# Altium schematic sheet STM32H745.SchDoc
size A
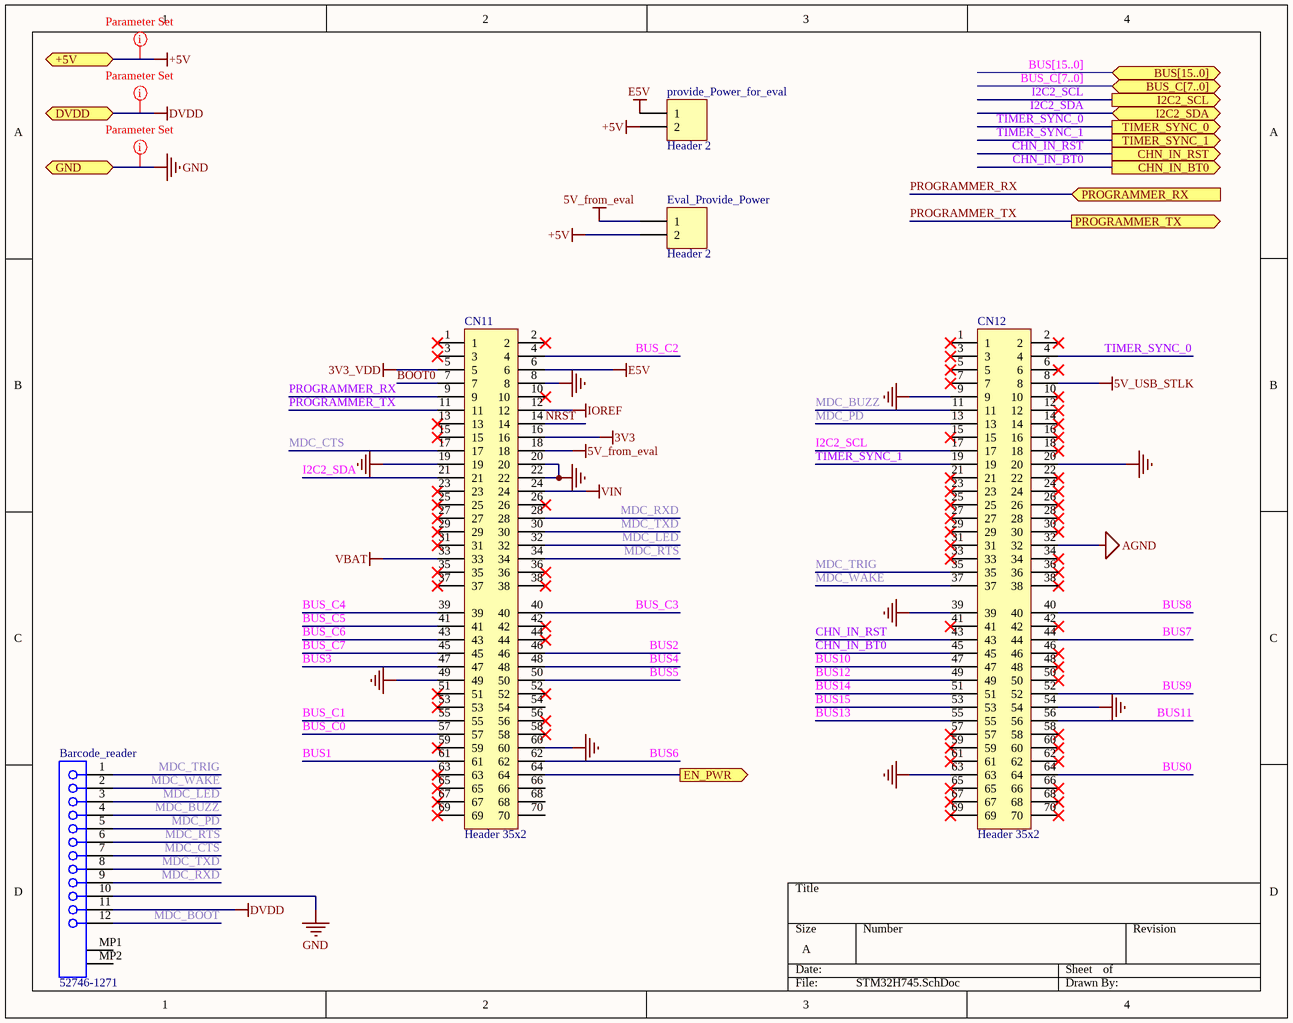
[diagram p0: STM32H745.SchDoc]

## Parts
Barcode_reader  52746-1271  [MOLX-52746-1271]
CN11  Header 35x2  [HDR_2x36_2R54_V_M]
CN12  Header 35x2  [HDR_2x36_2R54_V_M]
Eval_Provide_Power  Header 2  [HDR1X2]
provide_Power_for_eval  Header 2  [HDR1X2]

## Ports
+5V (bidir), BUS[15..0] (bidir), BUS_C[7..0] (bidir), CHN_IN_BT0 (out), CHN_IN_RST (out), DVDD (bidir), EN_PWR (out), GND (bidir), I2C2_SCL (out), I2C2_SDA (bidir), PROGRAMMER_RX (in), PROGRAMMER_TX (out), TIMER_SYNC_0 (out), TIMER_SYNC_1 (out)

## Nets
3V3: CN11.16
3V3_VDD: CN11.5
5V_from_eval: CN11.18 Eval_Provide_Power.1
5V_USB_STLK: CN12.8
+5V: Eval_Provide_Power.2 provide_Power_for_eval.2 ; port +5V
AGND: CN12.32
DVDD: Barcode_reader.11 ; port DVDD
E5V: CN11.6 provide_Power_for_eval.1
GND: Barcode_reader.10 CN11.8 CN11.19 CN11.20 CN11.22 CN11.49 CN11.60 CN12.9 CN12.20 CN12.39 CN12.54 CN12.63 ; port GND
IOREF: CN11.12
VBAT: CN11.33
VIN: CN11.24
BOOT0: CN11.7
BUS0: CN12.64
BUS1: CN11.61
BUS2: CN11.46
BUS3: CN11.47
BUS4: CN11.48
BUS5: CN11.50
BUS6: CN11.62
BUS7: CN12.44
BUS8: CN12.40
BUS9: CN12.52
BUS10: CN12.47
BUS11: CN12.56
BUS12: CN12.49
BUS13: CN12.55
BUS14: CN12.51
BUS15: CN12.53
BUS_C0: CN11.57
BUS_C1: CN11.55
BUS_C2: CN11.4
BUS_C3: CN11.40
BUS_C4: CN11.39
BUS_C5: CN11.41
BUS_C6: CN11.43
BUS_C7: CN11.45
CHN_IN_BT0: CN12.45 ; port CHN_IN_BT0
CHN_IN_RST: CN12.43 ; port CHN_IN_RST
EN_PWR: CN11.64 ; port EN_PWR
I2C2_SCL: CN12.17 ; port I2C2_SCL
I2C2_SDA: CN11.21 ; port I2C2_SDA
MDC_BOOT: Barcode_reader.12
MDC_BUZZ: Barcode_reader.4 CN12.11
MDC_CTS: Barcode_reader.7 CN11.17
MDC_LED: Barcode_reader.3 CN11.32
MDC_PD: Barcode_reader.5 CN12.13
MDC_RTS: Barcode_reader.6 CN11.34
MDC_RXD: Barcode_reader.9 CN11.28
MDC_TRIG: Barcode_reader.1 CN12.35
MDC_TXD: Barcode_reader.8 CN11.30
MDC_WAKE: Barcode_reader.2 CN12.37
NRST: CN11.14
PROGRAMMER_RX: CN11.9 ; port PROGRAMMER_RX
PROGRAMMER_TX: CN11.11 ; port PROGRAMMER_TX
TIMER_SYNC_0: CN12.4 ; port TIMER_SYNC_0
TIMER_SYNC_1: CN12.19 ; port TIMER_SYNC_1

Not connected (* = marked no-connect by the designer): Barcode_reader MP1 MP2; CN11 1* 2* 3* 10* 13* 15* 23* 25* 26* 27* 29* 31* 35* 36* 37* 38* 42* 44* 51* 52* 53* 54 56* 58* 59* 63* 65* 66 67* 68 69* 70; CN12 1* 2* 3* 5* 6* 7* 10* 12* 14* 15* 16* 18* 21* 22* 23* 24* 25* 26* 27* 28* 29* 30* 31* 33* 34* 36* 38* 41* 42* 46* 48* 50* 57* 58* 59* 60* 61* 62* 65* 66* 67* 68* 69* 70*

## Buses and harness runs
bus BUS[15..0] = port BUS[15..0]
bus BUS_C[7..0] = port BUS_C[7..0]

## Layout directives
net class Power: +5V, DVDD, GND

## Library data of the parts
Barcode_reader = CMP-1241-00374-1: 0.5 mm Pitch Easy-On(TM) Type FPC Connector, 2.0 mm Mated Height, Right Angle, ZIF, SMT, Bottom Contact, 12 Circuits, -20 to 85 degC, ELV and RoHS Compliant, Tape and Reel; Manufacturer: Molex; Pitch - Mating Interface: 0.50mm; PCB Retention: Yes; Current (Max per Contact): 0.5A; Material - Metal: Phosphor Bronze; Entry Angle: 90degrees Angle; Durability (mating cycles max): 20; Mated Height: 2.00mm; Circuits (Loaded): 12; Material - Plating Termination: Gold; Stackable: No; Voltage (Max): 50V; PackageReference: 52746-1271; Polarized to PCB: Yes; ComponentLink1Description: Manufacturer URL; ComponentLink1URL: http://www.molex.com/molex/index.jsp; ComponentLink2URL: http://www.molex.com/webdocs/datasheets/pdf/en-us/0527461271_FFC_FPC_CONNECTORS.pdf; Mounting Technology: Surface Mount; Orientation: Right Angle; Packing: Tape and Reel; ComponentLink3Description: Package Specification; ComponentLink3URL: http://www.molex.com/pdm_docs/sd/527461271_sd.pdf; Number of Rows: 1; Contact Position: Bottom; PackageVersion: Rev. H, 05/2009; RoHS: TRUE; Material - Plating Mating: Gold; PartNumber: 52746-1271; ComponentLink2Description: Datasheet; PCB Locator: No; PackageDescription: 12-Lead FPC Connector, Pitch 0.5 mm
CN11 CN12 = MCD-01210: Header, 35x2, 2,54mm, VR, TH, Height 5.84mm/2.54mm; Parameter 1: 929975E-01-36-ND; ComponentLink1Description: digikey; ComponentLink1URL: https://www.digikey.com/en/products/detail/929975-01-36-RK/929975E-01-36-ND/1094325?itemSeq=354777972
Eval_Provide_Power provide_Power_for_eval = Header 2: Header, 2-Pin; LatestRevisionDate: 17-Jul-2002; LatestRevisionNote: Re-released for DXP Platform.; Publisher: Altium Limited; ComponentLink1Description: digikey; ComponentLink1URL: https://www.digikey.com/en/products/detail/61300211121/732-5315-ND/4846823?itemSeq=354348989; digikey_part_NO: 732-5315-ND